# EAGLE design WTV020 (EAGLE 6.1)
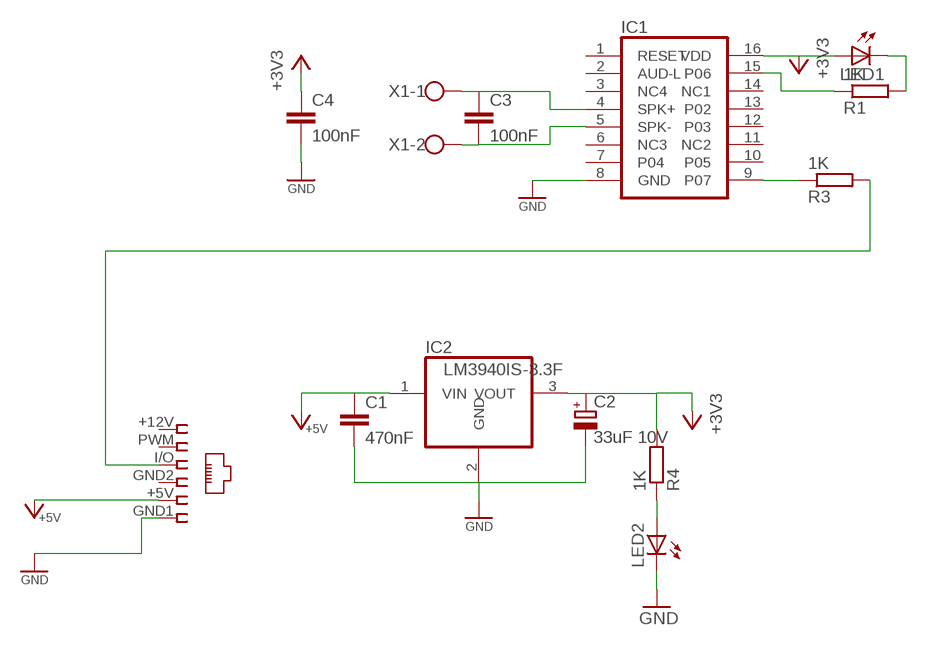
[diagram p0: schematic, sheet 1]

## Parts
C1  470nF  C-EUC1206  [C1206]
C2  33uF 10V  CPOL-EUE3.5-8  [E3,5-8]
C3  100nF  C-EUC1206  [C1206]
C4  100nF  C-EUC1206  [C1206]
I2C_IN  I2C 1  RJ12STRAIGHT  [RJ12-STRAIGHT]
IC1  WTV020  [DIL16-6]
IC2  LM3940IS-3.3F  [DD-3]
LED1  LED3MM  [LED3MM]
LED2  LED3MM  [LED3MM]
R1  1K  R-EU_M1206  [M1206]
R3  1K  R-EU_M1206  [M1206]
R4  1K  R-EU_M1206  [M1206]
X1  W237-102  [W237-102]

## Nets
+3V3 [power]: C2.+ C4.1 IC1.16(VDD) IC2.3(VOUT) LED1.A R4.2
+5V [power]: C1.1 I2C_IN.+5V IC2.1(VIN)
GND [power]: C1.2 C2.- C4.2 I2C_IN.GND1 IC1.8(GND) IC2.2(GND) LED2.K(C)
N$1: IC1.9(P07) R3.1
N$2: LED1.K(C) R1.2
N$3: IC1.15(P06) R1.1
N$4: C3.1 IC1.4(SPK+) X1.1
N$5: C3.2 IC1.5(SPK-) X1.2
N$23: LED2.A R4.1
SDA: I2C_IN.I/O R3.2
Unconnected: I2C_IN.PWM IC1.1(RESET) IC1.2(AUD-L) IC1.3(NC4) IC1.6(NC3) IC1.7(P04) IC1.10(P05) IC1.11(NC2) IC1.12(P03) IC1.13(P02) IC1.14(NC1)

## Power pins joined to a net without a drawn wire
1: I2C_IN.+12V
4: I2C_IN.GND2

## Library data of the parts
C1 C3 C4 = rcl:C-EU: CAPACITOR, European symbol
C2 = rcl:CPOL-EU: POLARIZED CAPACITOR, European symbol
I2C_IN = lpatiny:RJ12: CORCOM Modular RJ Jacks No Shield Source: www.tycoelectronics.com .. ENG_DS_1654001_1099_RJ_L_0507.pdf
IC1 = lpatiny:WTV020: Audio module
IC2 = lpatiny:LM3940IS-3.3: 1A Low Dropout (LDO) for 5V to 3.3V conversion; MF: TEXAS INSTRUMENTS; MPN: REG1117FAKTTT; OC_FARNELL: 1296120; OC_NEWARK: 87H2562
LED1 LED2 = lpatiny:LED3MM
R1 R3 R4 = resistor:R-EU_: RESISTOR, European symbol
X1 = con-wago-500:W237-102: WAGO SCREW CLAMP

## Net classes
0 default: width 0.457 mm
1 power: width 0.914 mm
2 highpower: width 1.372 mm

## Board
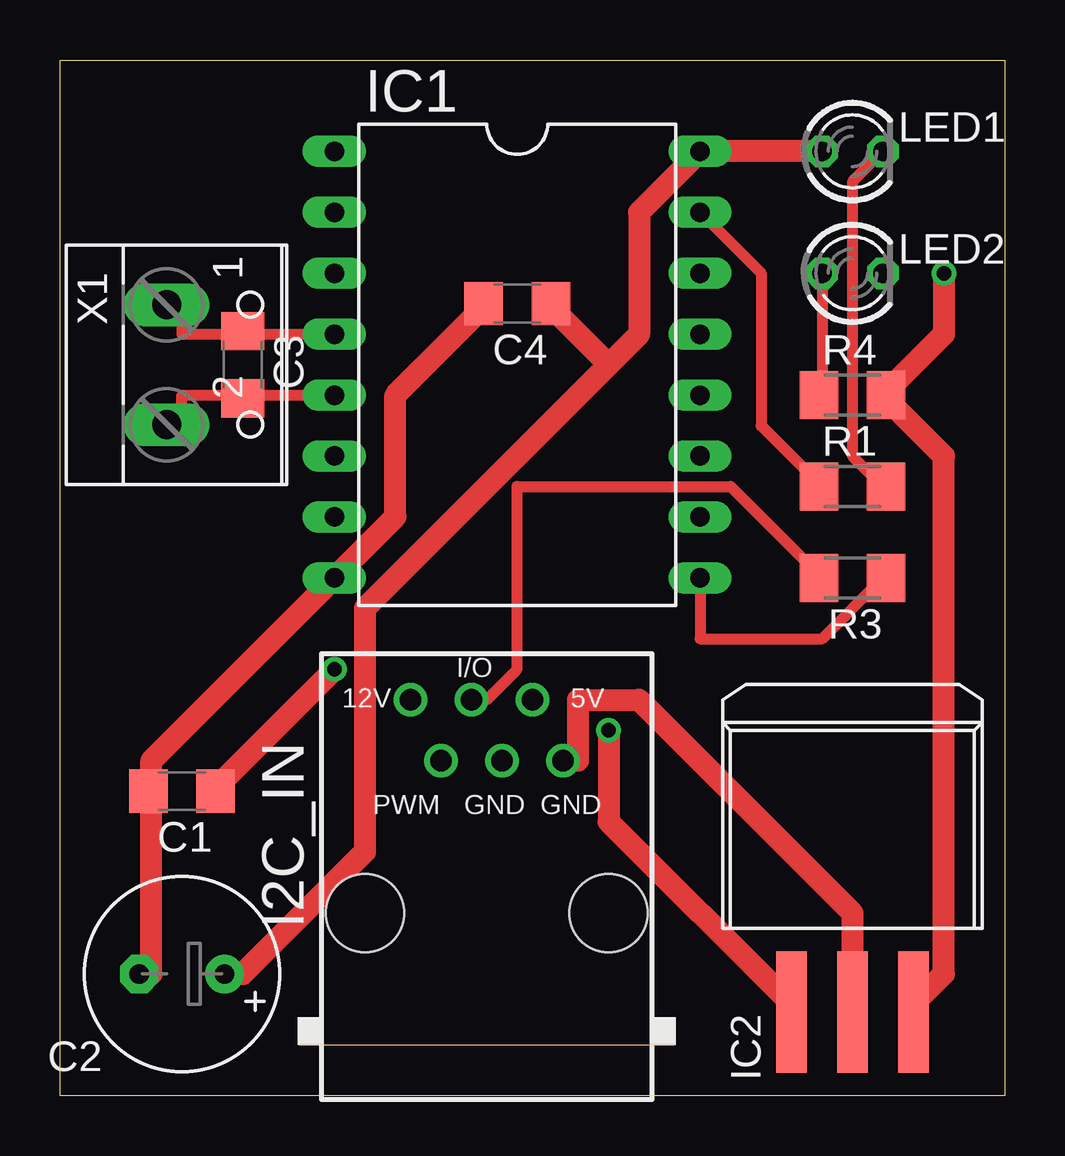
[diagram p1: board, top side]
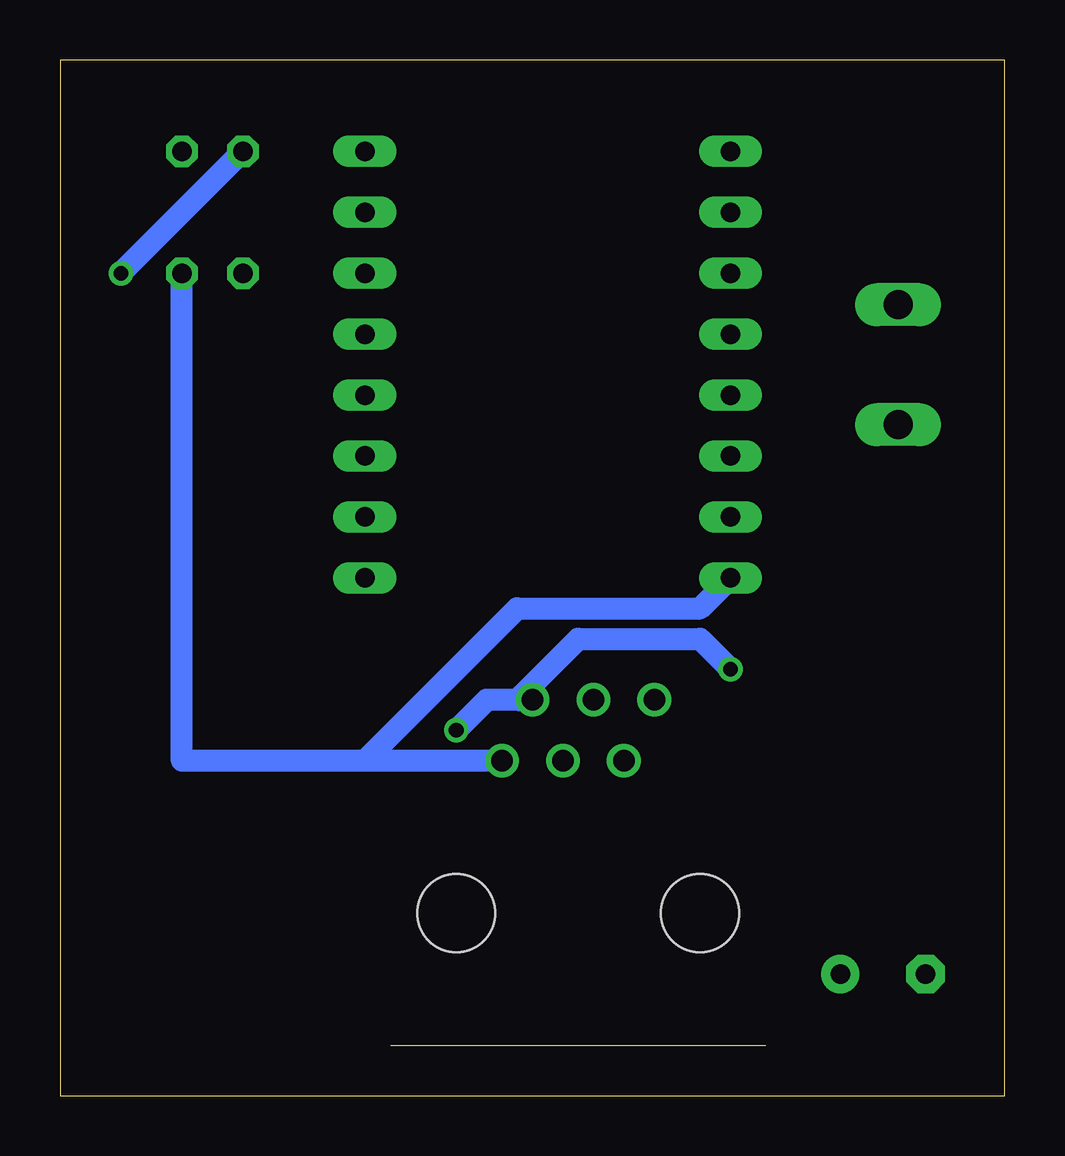
[diagram p2: board, bottom side, seen from below]

Size 39.37 x 43.18 mm. Coordinates in mm from the lower left corner, seen from the top.
Outline: 0,43.18 39.37,43.18 39.37,0 0,0 0,43.18
Copper layers (1*16): Top 0.035mm / dielectric 1.5mm / Bottom 0.035mm
Design rules: minimum track width 10mil, minimum drill 24mil, track to track 8mil, track to pad 8mil, pad to pad 8mil, via to via 8mil, smd to smd 8mil, copper to edge 40mil, drill to drill 8mil, minimum pad ring 10mil, minimum via ring 8mil, stop-mask expansion 4mil, vias tented up to drill 0mil, thermal gap 10mil
vRestrict: area 26.7,0 to 39.4,20.3
Milling: 4 lines

### Footprints (pad centres in the part's own frame; a part is rotated, then mirrored left to right if it is on the bottom)
C1206 = smd 1.6 x 1.8: 1 -1.4,0; 2 1.4,0
E3,5-8 = drill 0.813 pad 1.6: + -1.778,0 | drill 0.813 pad 1.6 octagon: - 1.778,0
RJ12-STRAIGHT = drill 0.9 pad 1.4: +5V 1.905,8.89; +12V -3.175,8.89; GND1 3.175,6.35; GND2 0.635,6.35; I/O -0.635,8.89; PWM -1.905,6.35 | hole 3.251: -5.08,0; 5.08,0
DIL16-6 = drill 0.813 long: 1 -13.97,-7.62; 2 -11.43,-7.62; 3 -8.89,-7.62; 4 -6.35,-7.62; 5 -3.81,-7.62; 6 -1.27,-7.62; 7 1.27,-7.62; 8 3.81,-7.62; 9 3.81,7.62; 10 1.27,7.62; 11 -1.27,7.62; 12 -3.81,7.62; 13 -6.35,7.62; 14 -8.89,7.62; 15 -11.43,7.62; 16 -13.97,7.62
DD-3 = smd 1.27 x 5.08: 1 -2.54,-7.938; 2 0,-7.938; 3 2.54,-7.938
LED3MM = drill 0.813 octagon: A -1.27,0; K 1.27,0
M1206 = smd 1.6 x 2: 1 -1.4,0; 2 1.4,0
W237-102 = drill 1.194 long: 1 -2.5,-1.27; 2 2.5,-1.27

### Placement (x,y rotation side)
C1  5.08,12.7 180 top
C2  5.08,5.08 180 top
C3  7.62,30.48 270 top
C4  19.05,33.02 180 top
I2C_IN  17.78,7.62 0 top
IC1  19.05,25.4 270 top
IC2  33.02,11.43 0 top
LED1  33.02,39.37 0 top
LED2  33.02,34.29 0 top
R1  33.02,25.4 0 top
R3  33.02,21.59 180 top
R4  33.02,29.21 0 top
X1  5.71,30.48 270 top

### Tracks (layer width: path | path; a pad name or v marks a point on that pad's centre or on a via)
+3V3  (via drill 0.61)
  Top 0.914: 34.29,29.21 36.83,26.67 36.83,5.08 35.56,3.81 IC2.3 | LED1.A IC1.16 24.13,36.83 24.13,31.75 22.86,30.48 | 22.86,30.48 12.7,20.32 12.7,10.16 7.62,5.08 C2.+ | 34.29,29.21 36.83,31.75 v36.83,34.29 | 34.29,29.21 R4.2 | 22.86,30.48 20.32,33.02 C4.1
  Bottom 0.914: LED1.A v36.83,34.29
+5V  (via drill 0.61)
  Top 0.914: v11.43,17.78 6.35,12.7 C1.1 | v22.86,15.24 22.86,11.43 30.48,3.81 IC2.1
  Bottom 0.914: v11.43,17.78 12.7,19.05 17.78,19.05 20.32,16.51 | v22.86,15.24 21.59,16.51 20.32,16.51 | 20.32,16.51 I2C_IN.+5V
GND
  Top 0.914: 3.81,12.7 3.81,5.08 C2.- | 3.81,12.7 3.81,13.97 IC1.8 13.97,24.13 13.97,29.21 17.78,33.02 C4.2 | 3.81,12.7 C1.2 | IC2.2 33.02,7.62 24.13,16.51 21.59,16.51 21.59,13.97 I2C_IN.GND1
  Bottom 0.914: LED2.K 34.29,13.97 26.67,13.97 | I2C_IN.GND1 26.67,13.97 | IC1.8 12.7,20.32 20.32,20.32 26.67,13.97
N$1
  Top 0.457: IC1.9 26.67,19.05 31.75,19.05 34.29,21.59 R3.1
N$2
  Top 0.457: LED1.K 33.02,38.1 33.02,26.67 34.29,25.4 R1.2
N$3
  Top 0.457: IC1.15 29.21,34.29 29.21,27.94 31.75,25.4 R1.1
N$4
  Top 0.457: 7.62,31.75 5.08,31.75 5.08,33.02 X1.1 | 7.62,31.75 IC1.4 | 7.62,31.75 C3.1
N$5
  Top 0.457: 7.62,29.21 5.08,29.21 5.08,27.94 X1.2 | 7.62,29.21 IC1.5 | 7.62,29.21 C3.2
N$23
  Top 0.457: LED2.A 31.75,29.21 R4.1
SDA
  Top 0.457: R3.2 31.75,21.59 27.94,25.4 19.05,25.4 19.05,17.78 17.78,16.51 I2C_IN.I/O